# Altium project ISM_FEM.PrjPcb
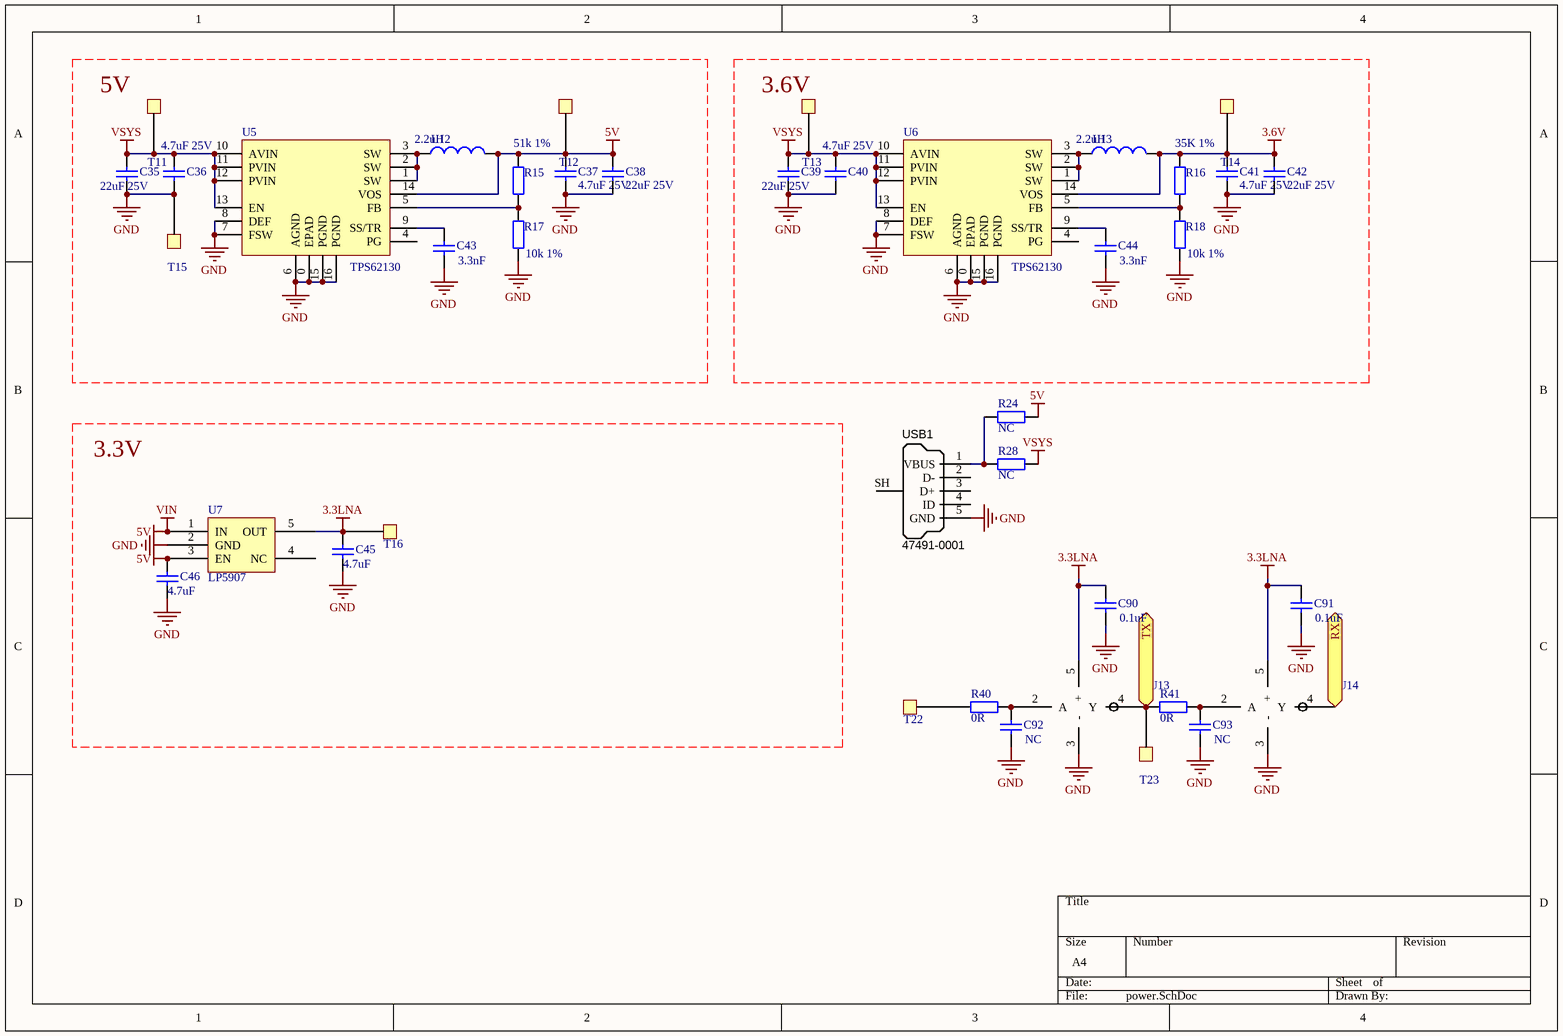
[diagram p0: power.SchDoc]
6 sheets, 238 parts. Net scope: flat (ports and power ports of the same name join across sheets).
Board file: FEM.PcbDoc
Sheets:
  power.SchDoc
  2.4FEM.SchDoc
  5.8FEM.SchDoc
  400M.SchDoc
  Wideband.SchDoc
  Detector.SchDoc

## Sheet power.SchDoc
size A4

### Parts
C35  value 22uF 25V  [1210]  (hidden comment: Cap)
C36  value 4.7uF 25V  [0805]  (hidden comment: Cap)
C37  value 4.7uF 25V  [0805]  (hidden comment: Cap)
C38  value 22uF 25V  [1210]  (hidden comment: Cap)
C39  value 22uF 25V  [1210]  (hidden comment: Cap)
C40  value 4.7uF 25V  [0805]  (hidden comment: Cap)
C41  value 4.7uF 25V  [0805]  (hidden comment: Cap)
C42  value 22uF 25V  [1210]  (hidden comment: Cap)
C43  3.3nF  [0402]
C44  3.3nF  [0402]
C45  4.7uF  [0603]
C46  4.7uF  [0603]
C90  0.1uF  [0402]
C91  0.1uF  [0402]
C92  NC  [0402]
C93  NC  [0402]
L12  2.2uH  [L3015]
L13  2.2uH  [L3015]
R15  51k 1%  [0402]
R16  35K 1%  [0402]
R17  10k 1%  [0402]
R18  10k 1%  [0402]
R24  NC  [0603]
R28  NC  [0603]
R40  0R  [0402]
R41  0R  [0402]
T11  TestPad  [TestPad]  (value not drawn)
T12  TestPad  [TestPad - 1mm]  (value not drawn)
T13  TestPad  [TestPad - 1mm]  (value not drawn)
T14  TestPad  [TestPad - 1mm]  (value not drawn)
T15  TestPad  [TestPad]  (value not drawn)
T16  TestPad  [TestPad - 1mm]  (value not drawn)
T22  TestPad  [TestPad]  (value not drawn)
T23  TestPad  [TestPad]  (value not drawn)
U5  TPS62130  [TPS62130]
U6  TPS62130  [TPS62130]
U7  LP5907  [SOT23-5]
U13  INVERTER-SOT23  [SOT23-5]  (value not drawn)
U14  INVERTER-SOT23  [SOT23-5]  (value not drawn)
USB1  Manufacturer Part Number 1: 47491-0001  [MICRO-YZX]  (hidden comment: USB Micro Type B)

### Ports
RX, TX

### Nets
3.3LNA: C45.2 C90.1 C91.1 T16.1 U7.5(OUT) U13.5(+) U14.5(+)
3.6V: C41.2 C42.2 L13.2 R16.1 T14.1 U6.14(VOS)
5V: C37.2 C38.2 C46.2 L12.2 R15.1 R24.2 T12.1 U5.14(VOS) U7.1(IN) U7.3(EN)  [also labelled VIN]
GND: C35.2 C36.2 C37.1 C38.1 C39.2 C40.2 C41.1 C42.1 C43.2 C44.2 C45.1 C46.1 C90.2 C91.2 C92.2 C93.2 R17.2 R18.2 T15.1 U5.0(EPAD) U5.6(AGND) U5.7(FSW) U5.8(DEF) U5.15(PGND) U5.16(PGND) U6.0(EPAD) U6.6(AGND) U6.7(FSW) U6.8(DEF) U6.15(PGND) U6.16(PGND) U7.2(GND) U13.3(-) U14.3(-) USB1.5(GND)
VSYS: C35.1 C36.1 C39.1 C40.1 R28.2 T11.1 T13.1 U5.10(AVIN) U5.11(PVIN) U5.12(PVIN) U5.13(EN) U6.10(AVIN) U6.11(PVIN) U6.12(PVIN) U6.13(EN)
NetC43_1: C43.1 U5.9(SS/TR)
NetC44_1: C44.1 U6.9(SS/TR)
NetC92_1: C92.1 R40.2 U13.2(A)
NetC93_1: C93.1 R41.2 U14.2(A)
NetL12_1: L12.1 U5.1(SW) U5.2(SW) U5.3(SW)
NetL13_1: L13.1 U6.1(SW) U6.2(SW) U6.3(SW)
NetR15_2: R15.2 R17.1 U5.5(FB)
NetR16_2: R16.2 R18.1 U6.5(FB)
NetR24_1: R24.1 R28.1 USB1.1(VBUS)
NetR40_1: R40.1 T22.1
NetR41_1: R41.1 T23.1 U13.4(Y) ; port TX
NetT4_1: U14.4(Y) ; port RX

Not connected (* = marked no-connect by the designer): U5 4(PG); U6 4(PG); U7 4(NC); USB1 2(D-) 3(D+) 4(ID) SH(Shell)

### Notes on the sheet
- (near T11) 5V
- (near T13) 3.6V
- 3.3V

### Library data of the parts
C35-C46 C90-C93 = Cap: Capacitor; Published: 8-Jun-2000; LatestRevisionDate: 17-Jul-2002; LatestRevisionNote: Re-released for DXP Platform.; PackageReference: RAD-0.3; Publisher: Altium Limited; PackageDescription: Radial Cap, Thru-Hole; 2 Leads; 0.3 in Pin Spacing
L12 L13 = Inductor: Code_IEC: 1005; Published: 8-Jun-2000; LatestRevisionDate: 29-May-2009; LatestRevisionNote: IPC-7351 Footprint Added.; PackageReference: 0402-A; Publisher: Altium Limited; PackageDescription: Chip Inductor; Code_JEITA: 0402
R15-R18 R24 R28 R40 R41 = Res2: Resistor; Published: 8-Jun-2000; LatestRevisionDate: 17-Jul-2002; LatestRevisionNote: Re-released for DXP Platform.; PackageReference: AXIAL-0.4; Publisher: Altium Limited; PackageDescription: Axial Device, Thru-Hole; 2 Leads; 0.4 in Pin Spacing
USB1 = USB_Micro_TypeB: Connector SMD USB Micro Type B middle mount; Manufacturer 1: Molex Inc; SCDType: undef; Package / Case: SMD; Supplier 1: Digi-Key; Supplier Part Number 1: WM17142CT-ND

## Sheet 2.4FEM.SchDoc
size A4
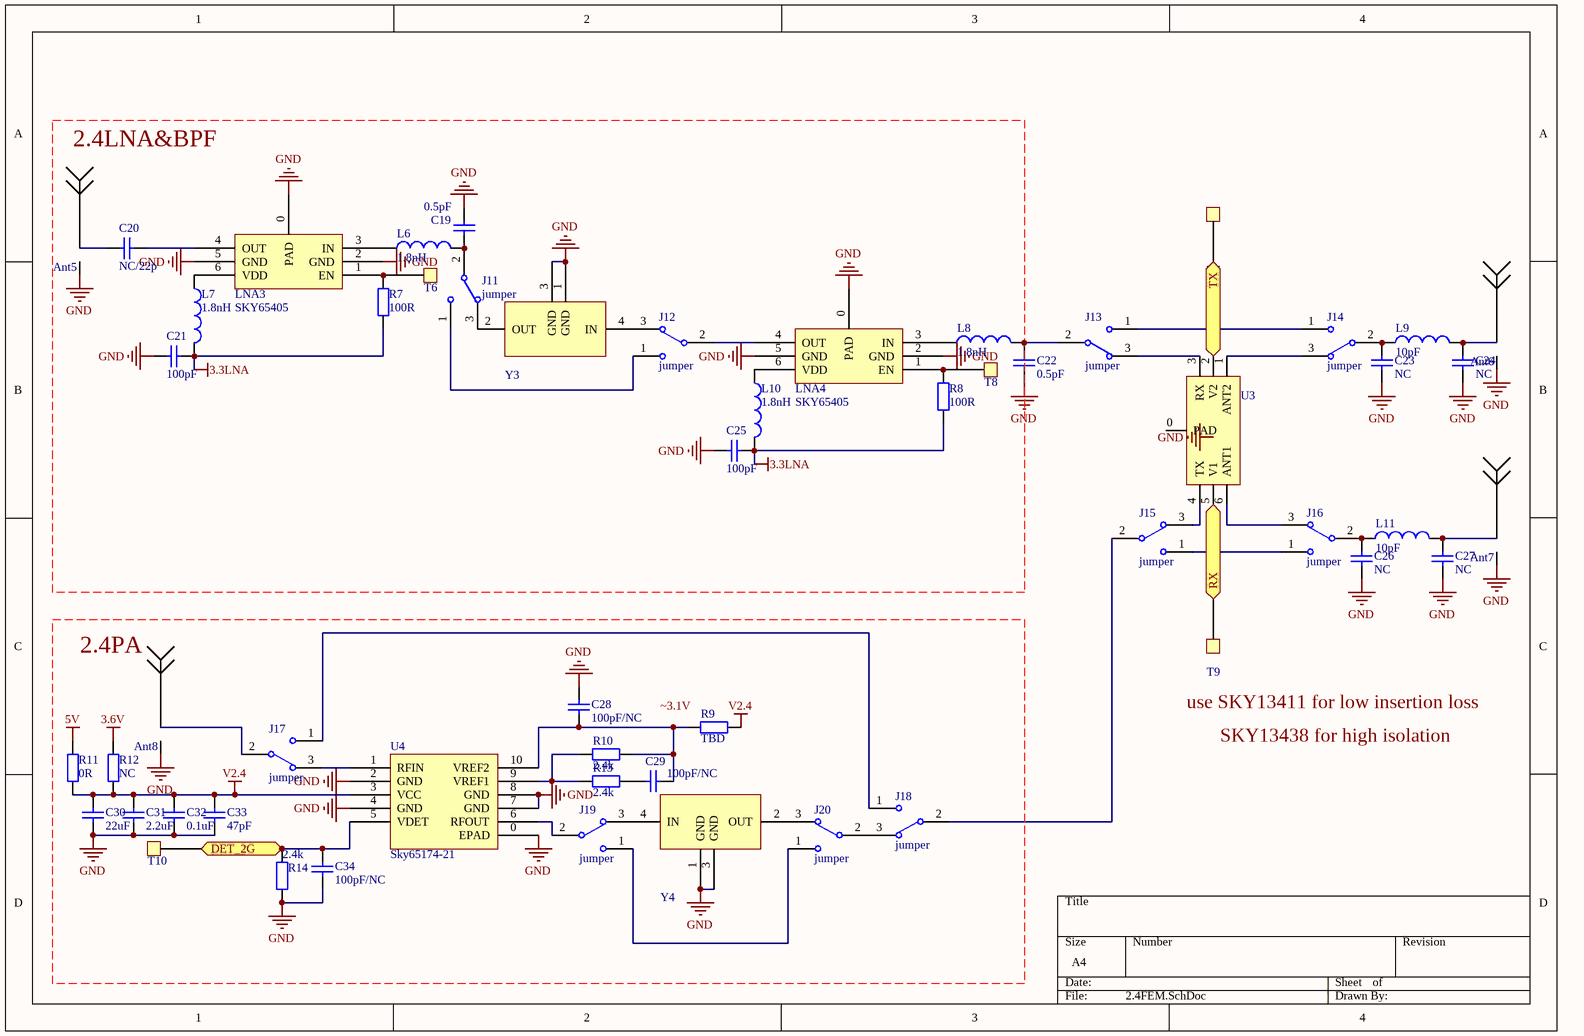
[diagram p1: 2.4FEM.SchDoc]

### Parts
Ant5  Antenna  [SMA-2]  (value not drawn)
Ant6  Antenna  [SMA-2]  (value not drawn)
Ant7  Antenna  [SMA-2]  (value not drawn)
Ant8  Antenna  [SMA-2]  (value not drawn)
C19  value 0.5pF  [0402]  (hidden comment: Cap)
C20  NC/22p  [0402]
C21  value 100pF  [0402]  (hidden comment: Cap)
C22  value 0.5pF  [0402]  (hidden comment: Cap)
C23  value NC  [0402]  (hidden comment: Cap)
C24  value NC  [0402]  (hidden comment: Cap)
C25  value 100pF  [0402]  (hidden comment: Cap)
C26  value NC  [0402]  (hidden comment: Cap)
C27  value NC  [0402]  (hidden comment: Cap)
C28  value 100pF/NC  [0402]  (hidden comment: Cap)
C29  value 100pF/NC  [0402]  (hidden comment: Cap)
C30  value 22uF  [0805]  (hidden comment: Cap)
C31  value 2.2uF  [0603]  (hidden comment: Cap)
C32  value 0.1uF  [0402]  (hidden comment: Cap)
C33  value 47pF  [0402]  (hidden comment: Cap)
C34  value 100pF/NC  [0402]  (hidden comment: Cap)
J11  jumper  [0402J]
J12  jumper  [0402J]
J13  jumper  [0402J]
J14  jumper  [0402J]
J15  jumper  [0402J]
J16  jumper  [0402J]
J17  jumper  [0402J]
J18  jumper  [0402J]
J19  jumper  [0402J]
J20  jumper  [0402J]
L6  value 1.8nH  [0402]  (hidden comment: Inductor)
L7  value 1.8nH  [0402]  (hidden comment: Inductor)
L8  value 1.8nH  [0402]  (hidden comment: Inductor)
L9  value 10pF  [0402]  (hidden comment: Inductor)
L10  value 1.8nH  [0402]  (hidden comment: Inductor)
L11  value 10pF  [0402]  (hidden comment: Inductor)
LNA3  SKY65405  [SKY65404-31]
LNA4  SKY65405  [SKY65404-31]
R7  value 100R  [0402]  (hidden comment: Res2)
R8  value 100R  [0402]  (hidden comment: Res2)
R9  value TBD  [0603]  (hidden comment: Res2)
R10  value 2.4k  [0402]  (hidden comment: Res2)
R11  value 0R  [0603]  (hidden comment: Res2)
R12  value NC  [0603]  (hidden comment: Res2)
R13  value 2.4k  [0402]  (hidden comment: Res2)
R14  value 2.4k  [0402]  (hidden comment: Res2)
T6  TestPad  [TestPad - 1mm]  (value not drawn)
T7  TestPad  [TestPad - 1mm]  (value not drawn)
T8  TestPad  [TestPad - 1mm]  (value not drawn)
T9  TestPad  [TestPad - 1mm]  (value not drawn)
T10  TestPad  [TestPad - 1mm]  (value not drawn)
U3  SKY13411  [SKY65404-31]  (value not drawn)
U4  Sky65174-21  [SKY65174-21]
Y3  2450BP39C100A  [2450BP39C100A]  (value not drawn)
Y4  2450BP39C100A  [2450BP39C100A]  (value not drawn)

### Ports
DET_2G, RX, TX

### Nets
3.3LNA: C21.2 C25.2 L7.2 L10.2 R7.2 R8.2
3.6V: R12.1
5V: R11.1
GND: Ant5.GND(G) Ant6.GND(G) Ant7.GND(G) Ant8.GND(G) C19.1 C21.1 C22.1 C23.1 C24.1 C25.1 C26.1 C27.1 C28.1 C30.2 C31.2 C32.2 C33.2 C34.2 LNA3.0(PAD) LNA3.2(GND) LNA3.5(GND) LNA4.0(PAD) LNA4.2(GND) LNA4.5(GND) R14.1 U4.0(EPAD) U4.2(GND) U4.4(GND) U4.7(GND) U4.8(GND) Y3.1(GND) Y3.3(GND) Y4.1(GND) Y4.3(GND)
V2.4: C30.1 C31.1 C32.1 C33.1 R9.1 R11.2 R12.2 U4.3(VCC)
NetAnt5_1: Ant5.1 C20.1
NetAnt6_1: Ant6.1 C24.2 L9.2
NetAnt7_1: Ant7.1 C27.2 L11.2
NetAnt8_1: Ant8.1 J17.2
NetC19_2: C19.2 J11.2 L6.2
NetC20_2: C20.2 LNA3.4(OUT)
NetC22_2: C22.2 J13.2 L8.2
NetC23_2: C23.2 J14.2 L9.1
NetC26_2: C26.2 J16.2 L11.1
NetC28_2: C28.2 C29.2 R9.2 R10.1 U4.10(VREF2)
NetC29_1: C29.1 R13.1
NetC34_1: C34.1 R14.2 T10.1 U4.5(VDET) ; port DET_2G
NetJ11_1: J11.1 J12.1
NetJ11_3: J11.3 Y3.2(OUT)
NetJ12_2: J12.2 LNA4.4(OUT)
NetJ12_3: J12.3 Y3.4(IN)
NetJ13_1: J13.1 J14.1
NetJ13_3: J13.3 U3.3(RX)
NetJ14_3: J14.3 U3.1(ANT2)
NetJ15_1: J15.1 J16.1
NetJ15_2: J15.2 J18.2
NetJ15_3: J15.3 U3.4(TX)
NetJ16_3: J16.3 U3.6(ANT1)
NetJ17_1: J17.1 J18.1
NetJ17_3: J17.3 U4.1(RFIN)
NetJ18_3: J18.3 J20.2
NetJ19_1: J19.1 J20.1
NetJ19_2: J19.2 U4.6(RFOUT)
NetJ19_3: J19.3 Y4.4(IN)
NetJ20_3: J20.3 Y4.2(OUT)
NetL6_1: L6.1 LNA3.3(IN)
NetL7_1: L7.1 LNA3.6(VDD)
NetL8_1: L8.1 LNA4.3(IN)
NetL10_1: L10.1 LNA4.6(VDD)
NetLNA3_1: LNA3.1(EN) R7.1 T6.1
NetLNA4_1: LNA4.1(EN) R8.1 T8.1
NetR10_2: R10.2 R13.2 U4.9(VREF1)
NetR41_1: T7.1 U3.2(V2) ; port TX
NetT4_1: T9.1 U3.5(V1) ; port RX

Not connected (* = marked no-connect by the designer): U3 0(PAD)

### Notes on the sheet
- 2.4LNA&BPF
- (near Ant8) 2.4PA
- (near T9) use SKY13411 for low insertion loss
- SKY13438 for high isolation
- Labels drawn without touching a wire or pin: GND, ~3.1V

### Library data of the parts
C19-C34 = Cap: Capacitor; Published: 8-Jun-2000; LatestRevisionDate: 17-Jul-2002; LatestRevisionNote: Re-released for DXP Platform.; PackageReference: RAD-0.3; Publisher: Altium Limited; PackageDescription: Radial Cap, Thru-Hole; 2 Leads; 0.3 in Pin Spacing
J11-J20 = SW-SPDT: SPDT Subminiature Toggle Switch, Right Angle Mounting, Vertical Actuation; Published: 24-Mar-1999; LatestRevisionDate: 17-Dec-2003; LatestRevisionNote: Schematic revised, PCB Footprint replaced.; DatasheetVersion: 05-Dec-2000; PackageReference: TL36WW15050; Publisher: Altium Limited; PackageDescription: Switch; 4 Leads; ComponentLink1Description: Manufacturer Link; ComponentLink1URL: http://www.apem.com
L6-L11 = Inductor: Code_IEC: 1005; Published: 8-Jun-2000; LatestRevisionDate: 29-May-2009; LatestRevisionNote: IPC-7351 Footprint Added.; PackageReference: 0402-A; Publisher: Altium Limited; PackageDescription: Chip Inductor; Code_JEITA: 0402
LNA3 LNA4 = SKY65404-31
R7-R14 = Res2: Resistor; Published: 8-Jun-2000; LatestRevisionDate: 17-Jul-2002; LatestRevisionNote: Re-released for DXP Platform.; PackageReference: AXIAL-0.4; Publisher: Altium Limited; PackageDescription: Axial Device, Thru-Hole; 2 Leads; 0.4 in Pin Spacing

## Sheet 5.8FEM.SchDoc
size A4
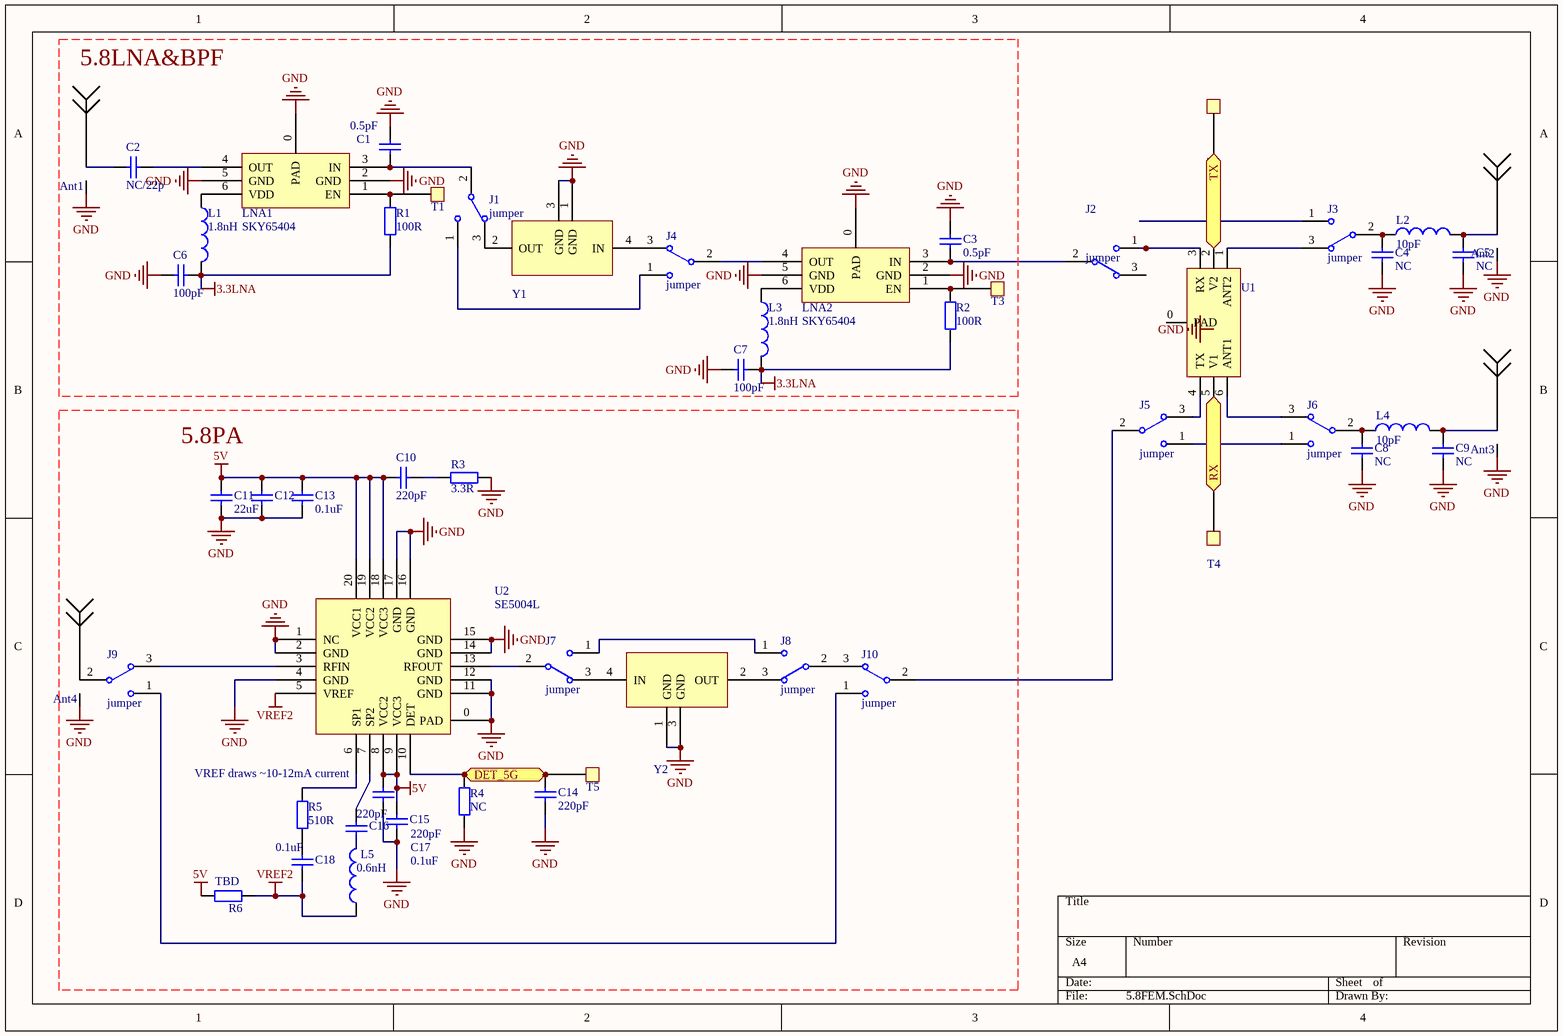
[diagram p2: 5.8FEM.SchDoc]

### Parts
Ant1  Antenna  [SMA-2]  (value not drawn)
Ant2  Antenna  [SMA-2]  (value not drawn)
Ant3  Antenna  [SMA-2]  (value not drawn)
Ant4  Antenna  [SMA-2]  (value not drawn)
C1  value 0.5pF  [0402]  (hidden comment: Cap)
C2  NC/22p  [0402]
C3  value 0.5pF  [0402]  (hidden comment: Cap)
C4  value NC  [0402]  (hidden comment: Cap)
C5  value NC  [0402]  (hidden comment: Cap)
C6  value 100pF  [0402]  (hidden comment: Cap)
C7  value 100pF  [0402]  (hidden comment: Cap)
C8  value NC  [0402]  (hidden comment: Cap)
C9  value NC  [0402]  (hidden comment: Cap)
C10  value 220pF  [0402]  (hidden comment: Cap)
C11  value 22uF  [0805]  (hidden comment: Cap)
C12  1uF  [0603]  (value not drawn)
C13  value 0.1uF  [0402]  (hidden comment: Cap)
C14  value 220pF  [0402]  (hidden comment: Cap)
C15  value 0.1uF  [0402]  (hidden comment: Cap)
C16  value 220pF  [0402]  (hidden comment: Cap)
C17  value 220pF  [0402]  (hidden comment: Cap)
C18  value 0.1uF  [0402]  (hidden comment: Cap)
J1  jumper  [0402J]
J2  jumper  [0402J]
J3  jumper  [0402J]
J4  jumper  [0402J]
J5  jumper  [0402J]
J6  jumper  [0402J]
J7  jumper  [0402J]
J8  jumper  [0402J]
J9  jumper  [0402J]
J10  jumper  [0402J]
L1  value 1.8nH  [0402]  (hidden comment: Inductor)
L2  value 10pF  [0402]  (hidden comment: Inductor)
L3  value 1.8nH  [0402]  (hidden comment: Inductor)
L4  value 10pF  [0402]  (hidden comment: Inductor)
L5  value 0.6nH  [0402]  (hidden comment: Inductor)
LNA1  SKY65404  [SKY65404-31]
LNA2  SKY65404  [SKY65404-31]
R1  value 100R  [0402]  (hidden comment: Res2)
R2  value 100R  [0402]  (hidden comment: Res2)
R3  value 3.3R  [0402]  (hidden comment: Res2)
R4  value NC  [0402]  (hidden comment: Res2)
R5  value 510R  [0402]  (hidden comment: Res2)
R6  TBD  [0603]
T1  TestPad  [TestPad - 1mm]  (value not drawn)
T2  TestPad  [TestPad - 1mm]  (value not drawn)
T3  TestPad  [TestPad - 1mm]  (value not drawn)
T4  TestPad  [TestPad - 1mm]  (value not drawn)
T5  TestPad  [TestPad - 1mm]  (value not drawn)
U1  SKY13411  [SKY65404-31]  (value not drawn)
U2  SE5004L  [SE5004L]
Y1  2450BP39C100A  [2450BP39C100A]  (value not drawn)
Y2  2450BP39C100A  [2450BP39C100A]  (value not drawn)

### Ports
DET_5G, RX, TX

### Nets
3.3LNA: C6.2 C7.2 L1.2 L3.2 R1.2 R2.2
5V: C10.2 C11.2 C12.1 C13.1 C15.2 C17.2 R6.2 U2.8(VCC2) U2.9(VCC3) U2.18(VCC3) U2.19(VCC2) U2.20(VCC1)
GND: Ant1.GND(G) Ant2.GND(G) Ant3.GND(G) Ant4.GND(G) C1.1 C3.1 C4.1 C5.1 C6.1 C7.1 C8.1 C9.1 C11.1 C12.2 C13.2 C14.2 C15.1 C17.1 LNA1.0(PAD) LNA1.2(GND) LNA1.5(GND) LNA2.0(PAD) LNA2.2(GND) LNA2.5(GND) R3.1 R4.1 U2.0(PAD) U2.1(NC) U2.2(GND) U2.4(GND) U2.11(GND) U2.12(GND) U2.14(GND) U2.15(GND) U2.16(GND) U2.17(GND) Y1.1(GND) Y1.3(GND) Y2.1(GND) Y2.3(GND)
VREF2: C18.1 L5.1 R6.1 U2.5(VREF)
NetAnt1_1: Ant1.1 C2.1
NetAnt2_1: Ant2.1 C5.2 L2.2
NetAnt3_1: Ant3.1 C9.2 L4.2
NetAnt4_1: Ant4.1 J9.2
NetC1_2: C1.2 J1.2 LNA1.3(IN)
NetC2_2: C2.2 LNA1.4(OUT)
NetC3_2: C3.2 J2.2 LNA2.3(IN)
NetC4_2: C4.2 J3.2 L2.1
NetC8_2: C8.2 J6.2 L4.1
NetC10_1: C10.1 R3.2
NetC14_1: C14.1 R4.2 T5.1 U2.10(DET) ; port DET_5G
NetC16_1: C16.1 L5.2
NetC16_2: C16.2 U2.7(SP2)
NetC18_2: C18.2 R5.1
NetJ1_1: J1.1 J4.1
NetJ1_3: J1.3 Y1.2(OUT)
NetJ2_1: J2.1 U1.3(RX)
NetJ3_3: J3.3 U1.1(ANT2)
NetJ4_2: J4.2 LNA2.4(OUT)
NetJ4_3: J4.3 Y1.4(IN)
NetJ5_1: J5.1 J6.1
NetJ5_2: J5.2 J10.2
NetJ5_3: J5.3 U1.4(TX)
NetJ6_3: J6.3 U1.6(ANT1)
NetJ7_1: J7.1 J8.1
NetJ7_2: J7.2 U2.13(RFOUT)
NetJ7_3: J7.3 Y2.4(IN)
NetJ8_2: J8.2 J10.3
NetJ8_3: J8.3 Y2.2(OUT)
NetJ9_1: J9.1 J10.1
NetJ9_3: J9.3 U2.3(RFIN)
NetL1_1: L1.1 LNA1.6(VDD)
NetL3_1: L3.1 LNA2.6(VDD)
NetLNA1_1: LNA1.1(EN) R1.1 T1.1
NetLNA2_1: LNA2.1(EN) R2.1 T3.1
NetR5_2: R5.2 U2.6(SP1)
NetR41_1: T2.1 U1.2(V2) ; port TX
NetT4_1: T4.1 U1.5(V1) ; port RX

Not connected (* = marked no-connect by the designer): J2 3; J3 1; U1 0(PAD)

### Notes on the sheet
- 5.8LNA&BPF
- 5.8PA
- VREF draws ~10-12mA current
- Labels drawn without touching a wire or pin: GND

### Library data of the parts
C1-C18 = Cap: Capacitor; Published: 8-Jun-2000; LatestRevisionDate: 17-Jul-2002; LatestRevisionNote: Re-released for DXP Platform.; PackageReference: RAD-0.3; Publisher: Altium Limited; PackageDescription: Radial Cap, Thru-Hole; 2 Leads; 0.3 in Pin Spacing
J1-J10 = SW-SPDT: as J11 on sheet 2.4FEM; Published: 24-Mar-1999; LatestRevisionDate: 17-Dec-2003; LatestRevisionNote: Schematic revised, PCB Footprint replaced.; DatasheetVersion: 05-Dec-2000; PackageReference: TL36WW15050; Publisher: Altium Limited; PackageDescription: Switch; 4 Leads; ComponentLink1Description: Manufacturer Link; ComponentLink1URL: http://www.apem.com
L1-L5 = Inductor: Code_IEC: 1005; Published: 8-Jun-2000; LatestRevisionDate: 29-May-2009; LatestRevisionNote: IPC-7351 Footprint Added.; PackageReference: 0402-A; Publisher: Altium Limited; PackageDescription: Chip Inductor; Code_JEITA: 0402
LNA1 LNA2 = SKY65404-31
R1-R6 = Res2: Resistor; Published: 8-Jun-2000; LatestRevisionDate: 17-Jul-2002; LatestRevisionNote: Re-released for DXP Platform.; PackageReference: AXIAL-0.4; Publisher: Altium Limited; PackageDescription: Axial Device, Thru-Hole; 2 Leads; 0.4 in Pin Spacing

## Sheet 400M.SchDoc
size A4
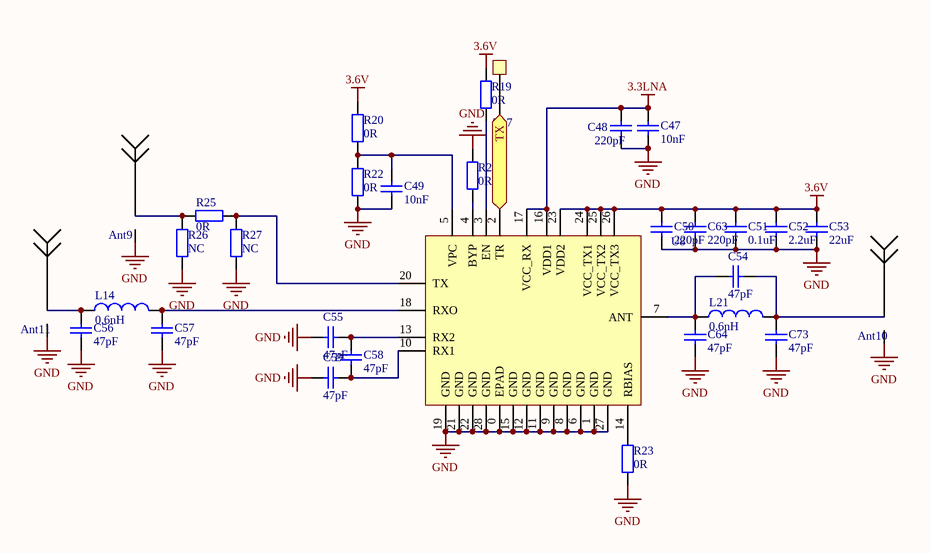
[diagram p3: 400M.SchDoc]

### Parts
Ant9  Antenna  [SMA-2]  (value not drawn)
Ant10  Antenna  [SMA-2]  (value not drawn)
Ant11  Antenna  [SMA-2]  (value not drawn)
C47  value 10nF  [0402]  (hidden comment: Cap)
C48  value 220pF  [0402]  (hidden comment: Cap)
C49  value 10nF  [0402]  (hidden comment: Cap)
C50  value 220pF  [0402]  (hidden comment: Cap)
C51  value 0.1uF  [0402]  (hidden comment: Cap)
C52  value 2.2uF  [0603]  (hidden comment: Cap)
C53  value 22uF  [0805]  (hidden comment: Cap)
C54  value 47pF  [0402]  (hidden comment: Cap)
C55  value 47pF  [0402]  (hidden comment: Cap)
C56  value 47pF  [0402]  (hidden comment: Cap)
C57  value 47pF  [0402]  (hidden comment: Cap)
C58  value 47pF  [0402]  (hidden comment: Cap)
C59  value 47pF  [0402]  (hidden comment: Cap)
C63  value 220pF  [0402]  (hidden comment: Cap)
C64  value 47pF  [0402]  (hidden comment: Cap)
C73  value 47pF  [0402]  (hidden comment: Cap)
L14  value 0.6nH  [0402]  (hidden comment: Inductor)
L21  value 0.6nH  [0402]  (hidden comment: Inductor)
R19  value 0R  [0402]  (hidden comment: Res2)
R20  value 0R  [0402]  (hidden comment: Res2)
R21  value 0R  [0402]  (hidden comment: Res2)
R22  value 0R  [0402]  (hidden comment: Res2)
R23  value 0R  [0402]  (hidden comment: Res2)
R25  value 0R  [0402]  (hidden comment: Res2)
R26  value NC  [0402]  (hidden comment: Res2)
R27  value NC  [0402]  (hidden comment: Res2)
T17  TestPad  [TestPad - 1mm]  (value not drawn)
U8  SKY65366  [SKY65366]  (value not drawn)

### Ports
TX

### Nets
3.3LNA: C47.2 C48.2 U8.16(VDD1) U8.17(VCC_RX)
3.6V: C50.2 C51.2 C52.2 C53.2 C63.2 R19.2 R20.1 U8.23(VDD2) U8.24(VCC_TX1) U8.25(VCC_TX2) U8.26(VCC_TX3)
GND: Ant9.GND(G) Ant10.GND(G) Ant11.GND(G) C47.1 C48.1 C49.2 C50.1 C51.1 C52.1 C53.1 C55.1 C56.1 C57.1 C59.1 C63.1 C64.1 C73.1 R21.2 R22.2 R23.2 R26.2 R27.2 U8.0(EPAD) U8.1(GND) U8.6(GND) U8.8(GND) U8.9(GND) U8.11(GND) U8.12(GND) U8.15(GND) U8.19(GND) U8.21(GND) U8.22(GND) U8.27(GND) U8.28(GND)
NetAnt9_1: Ant9.1 R25.1 R26.1
NetAnt10_1: Ant10.1 C54.2 C73.2 L21.2
NetAnt11_1: Ant11.1 C56.2 L14.1
NetC49_1: C49.1 R20.2 R22.1 U8.5(VPC)
NetC54_1: C54.1 C64.2 L21.1 U8.7(ANT)
NetC55_2: C55.2 C58.1 U8.13(RX2)
NetC57_2: C57.2 L14.2 U8.18(RXO)
NetC58_2: C58.2 C59.2 U8.10(RX1)
NetR19_1: R19.1 U8.3(EN)
NetR21_1: R21.1 U8.4(BYP)
NetR23_1: R23.1 U8.14(RBIAS)
NetR25_2: R25.2 R27.1 U8.20(TX)
NetR41_1: T17.1 U8.2(TR) ; port TX

### Library data of the parts
C47-C59 C63 C64 C73 = Cap: Capacitor; Published: 8-Jun-2000; LatestRevisionDate: 17-Jul-2002; LatestRevisionNote: Re-released for DXP Platform.; PackageReference: RAD-0.3; Publisher: Altium Limited; PackageDescription: Radial Cap, Thru-Hole; 2 Leads; 0.3 in Pin Spacing
L14 L21 = Inductor: Code_IEC: 1005; Published: 8-Jun-2000; LatestRevisionDate: 29-May-2009; LatestRevisionNote: IPC-7351 Footprint Added.; PackageReference: 0402-A; Publisher: Altium Limited; PackageDescription: Chip Inductor; Code_JEITA: 0402
R19-R23 R25-R27 = Res2: Resistor; Published: 8-Jun-2000; LatestRevisionDate: 17-Jul-2002; LatestRevisionNote: Re-released for DXP Platform.; PackageReference: AXIAL-0.4; Publisher: Altium Limited; PackageDescription: Axial Device, Thru-Hole; 2 Leads; 0.4 in Pin Spacing

## Sheet Wideband.SchDoc
size A4
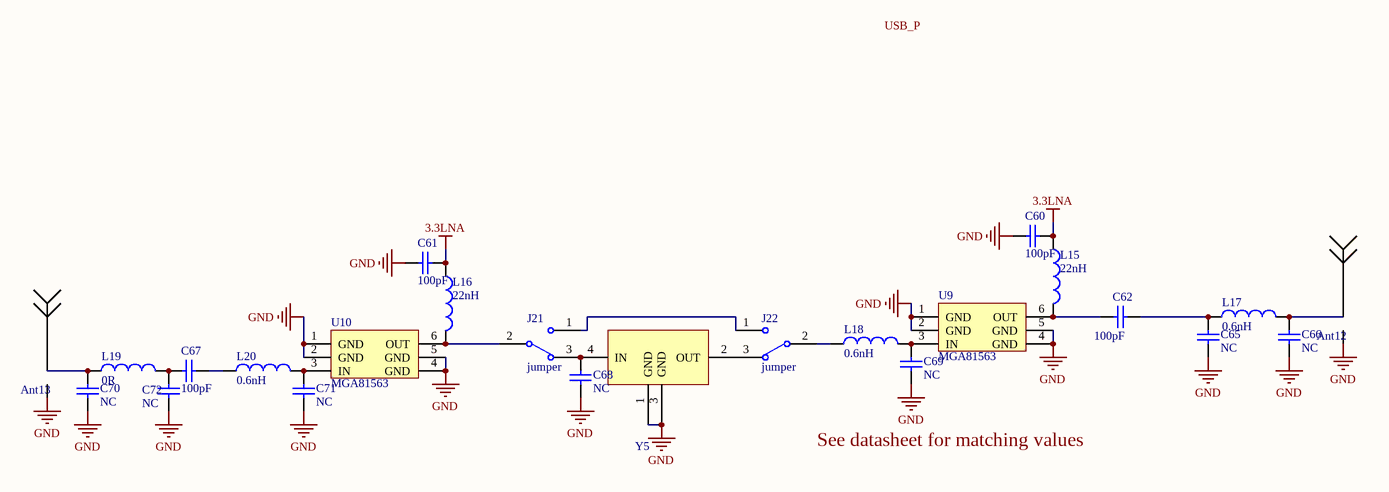
[diagram p4: Wideband.SchDoc]

### Parts
Ant12  Antenna  [SMA-2]  (value not drawn)
Ant13  Antenna  [SMA-2]  (value not drawn)
C60  value 100pF  [0402]  (hidden comment: Cap)
C61  value 100pF  [0402]  (hidden comment: Cap)
C62  value 100pF  [0402]  (hidden comment: Cap)
C65  value NC  [0402]  (hidden comment: Cap)
C66  value NC  [0402]  (hidden comment: Cap)
C67  value 100pF  [0402]  (hidden comment: Cap)
C68  value NC  [0402]  (hidden comment: Cap)
C69  value NC  [0402]  (hidden comment: Cap)
C70  value NC  [0402]  (hidden comment: Cap)
C71  value NC  [0402]  (hidden comment: Cap)
C72  value NC  [0402]  (hidden comment: Cap)
J21  jumper  [0402J]
J22  jumper  [0402J]
L15  value 22nH  [0603]  (hidden comment: Inductor)
L16  value 22nH  [0603]  (hidden comment: Inductor)
L17  value 0.6nH  [0402]  (hidden comment: Inductor)
L18  value 0.6nH  [0402]  (hidden comment: Inductor)
L19  value 0R  [0402]  (hidden comment: Inductor)
L20  value 0.6nH  [0402]  (hidden comment: Inductor)
U9  MGA81563  [SC-70-6]
U10  MGA81563  [SC-70-6]
Y5  2450BP39C100A  [2450BP39C100A]  (value not drawn)

### Nets
3.3LNA: C60.2 C61.2 L15.1 L16.1
GND: Ant12.GND(G) Ant13.GND(G) C60.1 C61.1 C65.1 C66.1 C68.1 C69.1 C70.1 C71.1 C72.1 U9.1(GND) U9.2(GND) U9.4(GND) U9.5(GND) U10.1(GND) U10.2(GND) U10.4(GND) U10.5(GND) Y5.1(GND) Y5.3(GND)
NetAnt12_1: Ant12.1 C66.2 L17.2
NetAnt13_1: Ant13.1 C70.2 L19.1
NetC62_1: C62.1 L15.2 U9.6(OUT)
NetC62_2: C62.2 C65.2 L17.1
NetC67_1: C67.1 C72.2 L19.2
NetC67_2: C67.2 L20.1
NetC68_2: C68.2 J21.3 Y5.4(IN)
NetC69_2: C69.2 L18.2 U9.3(IN)
NetC71_2: C71.2 L20.2 U10.3(IN)
NetJ21_1: J21.1 J22.1
NetJ21_2: J21.2 L16.2 U10.6(OUT)
NetJ22_2: J22.2 L18.1
NetJ22_3: J22.3 Y5.2(OUT)

### Notes on the sheet
- See datasheet for matching values
- Labels drawn without touching a wire or pin: USB_P

### Library data of the parts
C60-C62 C65-C72 = Cap: Capacitor; Published: 8-Jun-2000; LatestRevisionDate: 17-Jul-2002; LatestRevisionNote: Re-released for DXP Platform.; PackageReference: RAD-0.3; Publisher: Altium Limited; PackageDescription: Radial Cap, Thru-Hole; 2 Leads; 0.3 in Pin Spacing
J21 J22 = SW-SPDT: as J11 on sheet 2.4FEM; Published: 24-Mar-1999; LatestRevisionDate: 17-Dec-2003; LatestRevisionNote: Schematic revised, PCB Footprint replaced.; DatasheetVersion: 05-Dec-2000; PackageReference: TL36WW15050; Publisher: Altium Limited; PackageDescription: Switch; 4 Leads; ComponentLink1Description: Manufacturer Link; ComponentLink1URL: http://www.apem.com
L15-L20 = Inductor: Code_IEC: 1005; Published: 8-Jun-2000; LatestRevisionDate: 29-May-2009; LatestRevisionNote: IPC-7351 Footprint Added.; PackageReference: 0402-A; Publisher: Altium Limited; PackageDescription: Chip Inductor; Code_JEITA: 0402

## Sheet Detector.SchDoc
size A4
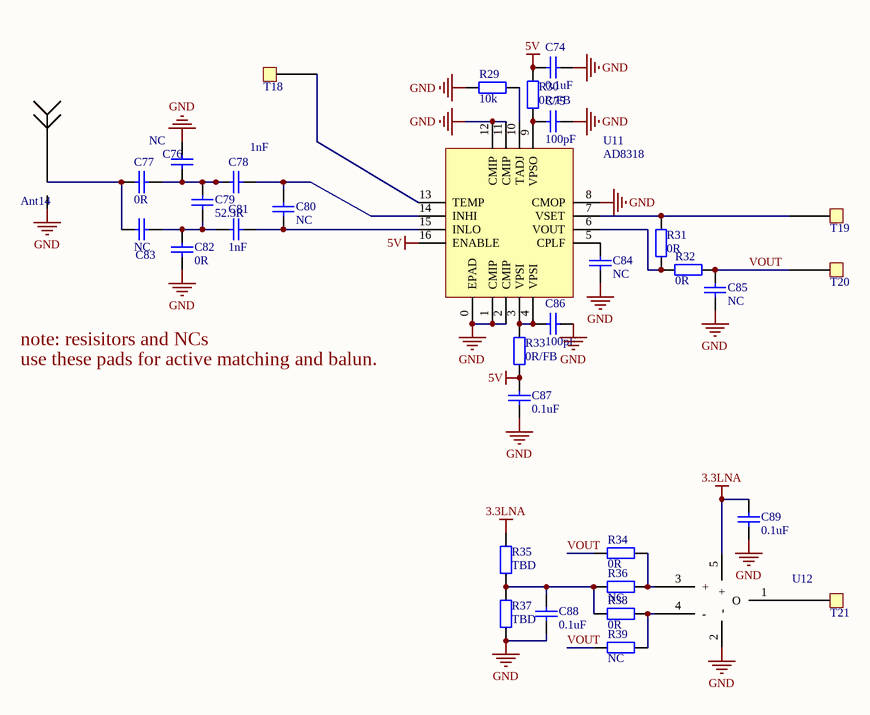
[diagram p5: Detector.SchDoc]

### Parts
Ant14  Antenna  [SMA-2]  (value not drawn)
C74  value 0.1uF  [0402]  (hidden comment: Cap)
C75  value 100pF  [0402]  (hidden comment: Cap)
C76  value NC  [0402]  (hidden comment: Cap)
C77  value 0R  [0402]  (hidden comment: Cap)
C78  value 1nF  [0402]  (hidden comment: Cap)
C79  value 52.3R  [0402]  (hidden comment: Cap)
C80  value NC  [0402]  (hidden comment: Cap)
C81  value 1nF  [0402]  (hidden comment: Cap)
C82  value 0R  [0402]  (hidden comment: Cap)
C83  value NC  [0402]  (hidden comment: Cap)
C84  value NC  [0402]  (hidden comment: Cap)
C85  value NC  [0402]  (hidden comment: Cap)
C86  value 100pF  [0402]  (hidden comment: Cap)
C87  value 0.1uF  [0402]  (hidden comment: Cap)
C88  value 0.1uF  [0402]  (hidden comment: Cap)
C89  value 0.1uF  [0402]  (hidden comment: Cap)
R29  value 10k  [0402]  (hidden comment: Res2)
R30  value 0R/FB  [0402]  (hidden comment: Res2)
R31  value 0R  [0402]  (hidden comment: Res2)
R32  value 0R  [0402]  (hidden comment: Res2)
R33  value 0R/FB  [0402]  (hidden comment: Res2)
R34  value 0R  [0402]  (hidden comment: Res2)
R35  value TBD  [0402]  (hidden comment: Res2)
R36  value NC  [0402]  (hidden comment: Res2)
R37  value TBD  [0402]  (hidden comment: Res2)
R38  value 0R  [0402]  (hidden comment: Res2)
R39  value NC  [0402]  (hidden comment: Res2)
T18  TestPad  [TestPad - 1mm]  (value not drawn)
T19  TestPad  [TestPad - 1mm]  (value not drawn)
T20  TestPad  [TestPad - 1mm]  (value not drawn)
T21  TestPad  [TestPad - 1mm]  (value not drawn)
U11  AD8318  [AD8318]
U12  CMP-SOT23  [SOT23-5]  (value not drawn)

### Nets
3.3LNA: C89.2 R35.1 U12.5(+)
5V: C74.2 C87.2 R30.1 R33.2 U11.16(ENABLE)
GND: Ant14.GND(G) C74.1 C75.1 C76.1 C82.1 C84.2 C85.2 C86.1 C87.1 C88.2 C89.1 R29.1 R37.1 U11.0(EPAD) U11.1(CMIP) U11.2(CMIP) U11.8(CMOP) U11.11(CMIP) U11.12(CMIP) U12.2(-)
VOUT: C85.1 R32.2 R34.2 R39.2 T20.1
NetAnt14_1: Ant14.1 C77.2 C83.2
NetC75_2: C75.2 R30.2 U11.9(VPSO)
NetC76_2: C76.2 C77.1 C78.2 C79.2
NetC78_1: C78.1 C80.2 U11.14(INHI)
NetC79_1: C79.1 C81.2 C82.2 C83.1
NetC80_1: C80.1 C81.1 U11.15(INLO)
NetC84_1: C84.1 U11.5(CPLF)
NetC86_2: C86.2 R33.1 U11.3(VPSI) U11.4(VPSI)
NetC88_1: C88.1 R35.2 R36.2 R37.2 R38.2
NetR29_2: R29.2 U11.10(TADJ)
NetR31_1: R31.1 T19.1 U11.7(VSET)
NetR31_2: R31.2 R32.1 U11.6(VOUT)
NetR34_1: R34.1 R36.1 U12.3(+)
NetR38_1: R38.1 R39.1 U12.4(-)
NetT18_1: T18.1 U11.13(TEMP)
NetT21_1: T21.1 U12.1(O)

### Notes on the sheet
- note: resisitors and NCs
- use these pads for active matching and balun.

### Library data of the parts
C74-C89 = Cap: Capacitor; Published: 8-Jun-2000; LatestRevisionDate: 17-Jul-2002; LatestRevisionNote: Re-released for DXP Platform.; PackageReference: RAD-0.3; Publisher: Altium Limited; PackageDescription: Radial Cap, Thru-Hole; 2 Leads; 0.3 in Pin Spacing
R29-R39 = Res2: Resistor; Published: 8-Jun-2000; LatestRevisionDate: 17-Jul-2002; LatestRevisionNote: Re-released for DXP Platform.; PackageReference: AXIAL-0.4; Publisher: Altium Limited; PackageDescription: Axial Device, Thru-Hole; 2 Leads; 0.4 in Pin Spacing

## Nets that join several sheets
3.3LNA: power (7 pins), 2.4FEM (6 pins), 5.8FEM (6 pins), 400M (C47.2 C48.2 U8.16 U8.17), Wideband (C60.2 C61.2 L15.1 L16.1), Detector (C89.2 R35.1 U12.5)
3.6V: power (6 pins), 2.4FEM (R12.1), 400M (11 pins)
5V: power (10 pins), 2.4FEM (R11.1), 5.8FEM (12 pins), Detector (5 pins)
GND: power (35 pins), 2.4FEM (34 pins), 5.8FEM (40 pins), 400M (35 pins), Wideband (21 pins), Detector (20 pins)
NetR41_1: power (R41.1 T23.1 U13.4), 2.4FEM (T7.1 U3.2), 5.8FEM (T2.1 U1.2), 400M (T17.1 U8.2)
NetT4_1: power (U14.4), 2.4FEM (T9.1 U3.5), 5.8FEM (T4.1 U1.5)